# Altium schematic sheet 06_Audio & HSMCI & TWI.SchDoc
size 420 x 297 mm
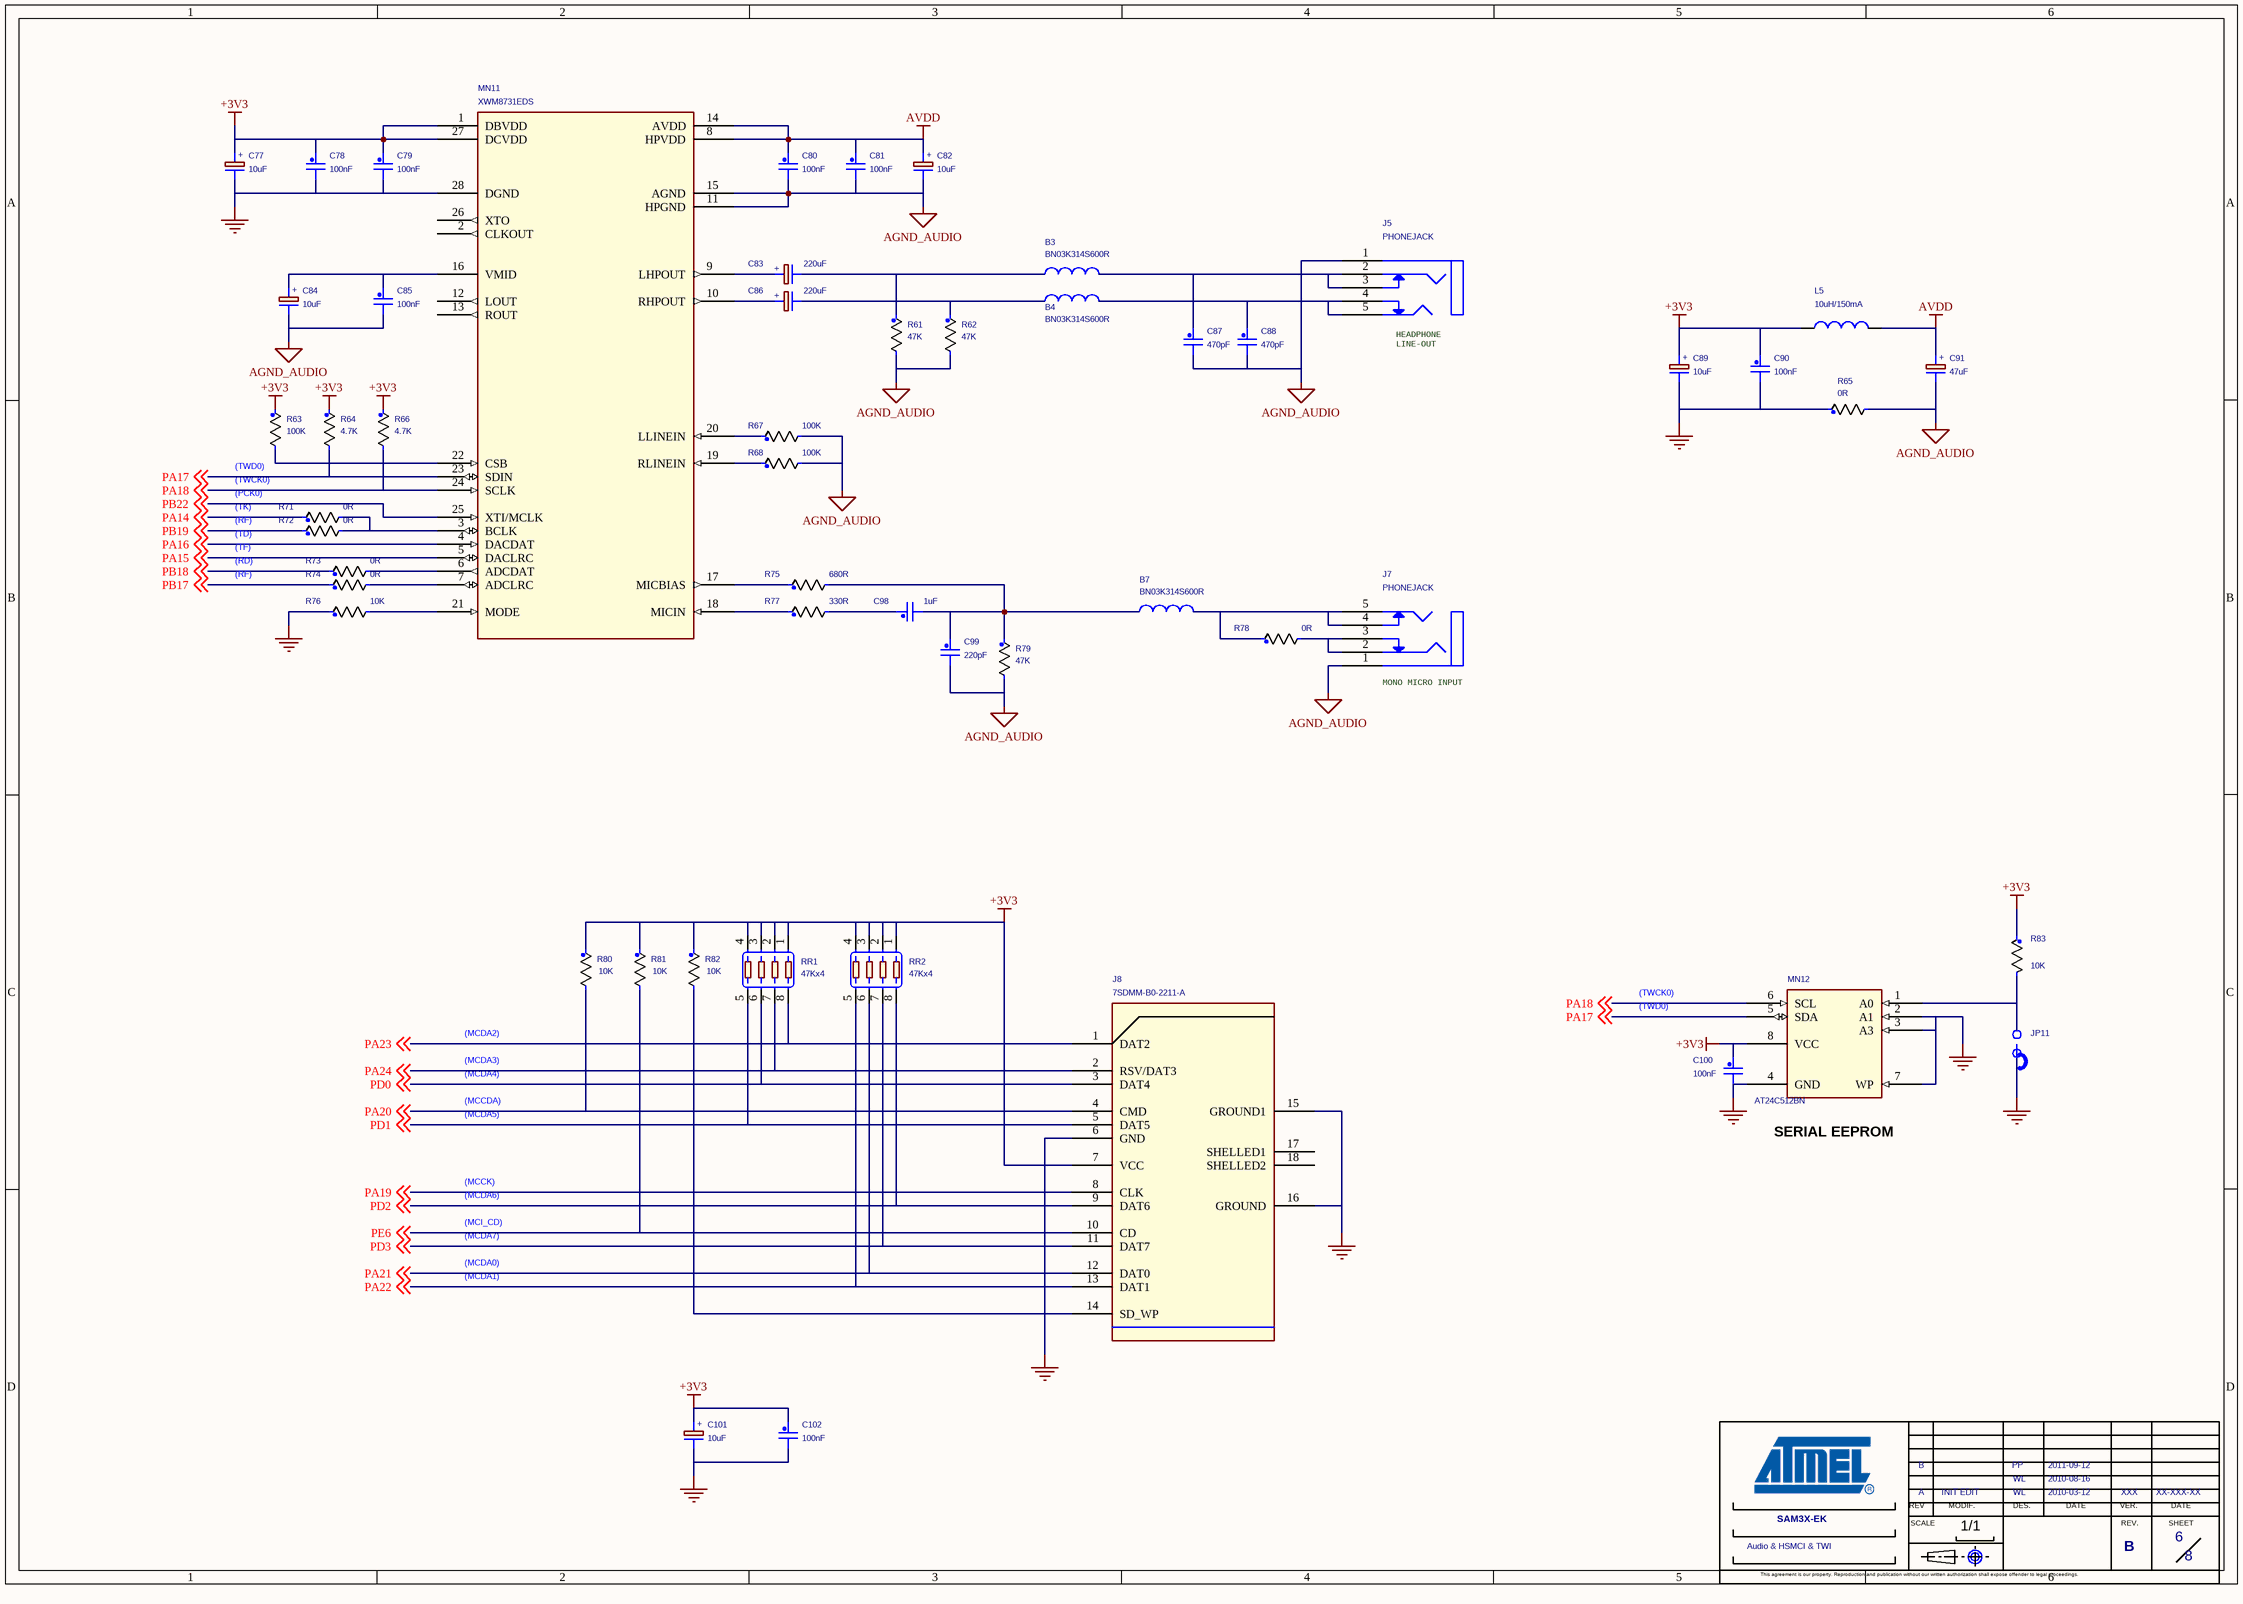
[diagram p0: 06_Audio & HSMCI & TWI.SchDoc]

## Parts
*  SHEET NAME 1: Audio & HSMCI & TWI  REV C: B  VERIF A: XXX  VERIF DATE A: XX-XXX-XX  Page Count: 8  Page Number: 6  DATE A: 2010-03-12  DATE B: 2010-08-16  DATE C: 2011-09-12  DES A: WL  DES C: PP  BOARD NAME: SAM3X-EK  VERSION: A  MODIF. DESCRIBE: INIT EDIT  (hidden comment: ATMEL ARM)  (graphical)
B3  BN03K314S600R  [LC1206]
B4  BN03K314S600R  [LC1206]
B7  BN03K314S600R  [LC1206]
C77  10uF  [C3216-18]
C78  100nF  [CAP0805]
C79  100nF  [CAP0805]
C80  100nF  [CAP0805]
C81  100nF  [CAP0805]
C82  10uF  [C3216-18]
C83  220uF  [T6032]
C84  10uF  [C3216-18]
C85  100nF  [CAP0805]
C86  220uF  [T6032]
C87  470pF  [CAP0805]
C88  470pF  [CAP0805]
C89  10uF  [C3216-18]
C90  100nF  [CAP0805]
C91  47uF  [C3528-21]
C98  1uF  [CAP0805]
C99  220pF  [CAP0805]
C100  100nF  [CAP0805]
C101  10uF  [C3216-18]
C102  100nF  [CAP0805]
J5  PHONEJACK  [audio_jack]
J7  PHONEJACK  [audio_jack]
J8  7SDMM-B0-2211-A  [sd-7sdmm]
JP11  JP  [BAR2PTS02]  (value not drawn)
L5  10uH/150mA  [NLFV25T]
MN11  XWM8731EDS  [TSSOP28]
MN12  AT24C512BN  [so8]
R61  47K  [R0603]
R62  47K  [R0603]
R63  100K  [R0603]
R64  4.7K  [R0603]
R65  0R  [R0603]
R66  4.7K  [R0603]
R67  100K  [R0603]
R68  100K  [R0603]
R71  0R  [R0603]
R72  0R  [R0603]
R73  0R  [R0603]
R74  0R  [R0603]
R75  680R  [R0603]
R76  10K  [R0603]
R77  330R  [R0603]
R78  0R  [R0603]
R79  47K  [R0603]
R80  10K  [R0603]
R81  10K  [R0603]
R82  10K  [R0603]
R83  10K  [R0603]
RR1  47Kx4  [RESP4R]
RR2  47Kx4  [RESP4R]
SH17  Jumper Pitch 2.54  [JUMPER-2.54]  (value not drawn)

## Nets
+3V3: C77.1 C78.1 C79.1 C89.1 C90.1 C100.1 C101.1 C102.1 J8.7(VCC) L5.2 MN11.1(DBVDD) MN11.27(DCVDD) MN12.8(VCC) R63.1 R64.1 R66.1 R80.1 R81.1 R82.1 R83.1 RR1.1 RR1.2 RR1.3 RR1.4 RR2.1 RR2.2 RR2.3 RR2.4
AGND_AUDIO: C80.2 C81.2 C82.2 C84.2 C85.2 C87.2 C88.2 C91.2 C99.2 J5.1(E) J7.1(E) MN11.11(HPGND) MN11.15(AGND) R61.2 R62.2 R65.2 R67.2 R68.2 R79.2
AVDD: C80.1 C81.1 C82.1 C91.1 L5.1 MN11.8(HPVDD) MN11.14(AVDD)
GND_POWER: C77.2 C78.2 C79.2 C89.2 C90.2 C100.2 C101.2 C102.2 J8.6(GND) J8.15(GROUND1) J8.16(GROUND) JP11.1 MN11.28(DGND) MN12.2(A1) MN12.3(A3) MN12.4(GND) MN12.7(WP) R65.1 R76.1
PA14: R71.1 ; off-sheet PA14
PA15: MN11.5(DACLRC) ; off-sheet PA15
PA16: MN11.4(DACDAT) ; off-sheet PA16
PA17: MN11.23(SDIN) MN12.5(SDA) R64.2 ; off-sheet PA17
PA18: MN11.24(SCLK) MN12.6(SCL) R66.2 ; off-sheet PA18
PA19: J8.8(CLK) ; off-sheet PA19
PA20: J8.4(CMD) R80.2 ; off-sheet PA20
PA21: J8.12(DAT0) RR2.6 ; off-sheet PA21
PA22: J8.13(DAT1) RR2.5 ; off-sheet PA22
PA23: J8.1(DAT2) RR1.8 ; off-sheet PA23
PA24: J8.2(RSV/DAT3) RR1.7 ; off-sheet PA24
PB17: R74.1 ; off-sheet PB17
PB18: R73.1 ; off-sheet PB18
PB19: R72.1 ; off-sheet PB19
PB22: MN11.25(XTI/MCLK) ; off-sheet PB22
PD0: J8.3(DAT4) RR1.6 ; off-sheet PD0
PD1: J8.5(DAT5) RR1.5 ; off-sheet PD1
PD2: J8.9(DAT6) RR2.8 ; off-sheet PD2
PD3: J8.11(DAT7) RR2.7 ; off-sheet PD3
PE6: J8.10(CD) R81.2 ; off-sheet PE6
NetB3_1: B3.1 C83.2 R61.1
NetB3_2: B3.2 C87.1 J5.2(D) J5.3(C)
NetB4_1: B4.1 C86.2 R62.1
NetB4_2: B4.2 C88.1 J5.4(B) J5.5(A)
NetB7_1: B7.1 C98.2 C99.1 R75.2 R79.1
NetB7_2: B7.2 J7.4(B) J7.5(A) R78.1
NetC83_1: C83.1 MN11.9(LHPOUT)
NetC84_1: C84.1 C85.1 MN11.16(VMID)
NetC86_1: C86.1 MN11.10(RHPOUT)
NetC98_1: C98.1 R77.2
NetJ7_2: J7.2(D) J7.3(C) R78.2
NetJ8_14: J8.14(SD_WP) R82.2
NetJP11_2: JP11.2 MN12.1(A0) R83.2
NetMN11_3: MN11.3(BCLK) R71.2 R72.2
NetMN11_6: MN11.6(ADCDAT) R73.2
NetMN11_7: MN11.7(ADCLRC) R74.2
NetMN11_17: MN11.17(MICBIAS) R75.1
NetMN11_18: MN11.18(MICIN) R77.1
NetMN11_19: MN11.19(RLINEIN) R68.1
NetMN11_20: MN11.20(LLINEIN) R67.1
NetMN11_21: MN11.21(MODE) R76.2
NetMN11_22: MN11.22(CSB) R63.2

Not connected (* = marked no-connect by the designer): J8 17(SHELLED1) 18(SHELLED2); MN11 2(CLKOUT) 12(LOUT) 13(ROUT) 26(XTO)

## Notes on the sheet
- (near J5) HEADPHONE
  LINE-OUT
- (near R63) (TWD0)
- (near R63) (TWCK0)
- (PCK0)
- (TK)
- (RF)
- (TD)
- (TF)
- (RD)
- (near J7) MONO MICRO INPUT
- (TWCK0)
- (MCDA2)
- (MCDA3)
- (TWD0)
- (MCCDA)
- (MCDA4)
- (MCDA5)
- SERIAL EEPROM
- (MCCK)
- (MCDA6)
- (MCDA7)
- (MCDA0)
- (MCI_CD)
- (MCDA1)
- (in symbol ATMEL ARM) REV; MODIF.; DES.; DATE; VER.; SCALE; REV.; SHEET; 1/1; This agreement is our property. Reproduction and publication without our written authorization shall expose offender to legal proceedings.
- (in symbol CAP_PN) +

## Library data of the parts
* = ATMEL ARM: REV D: D; REV F: F; REV E: E; REV B: B; VERIF F: XXX; VERIF E: XXX; VERIF D: XXX; VERIF C: XXX; VERIF B: XXX; VERIF DATE F: XX-XXX-XX; VERIF DATE E: XX-XXX-XX; VERIF DATE D: XX-XXX-XX; VERIF DATE C: XX-XXX-XX; REV: B; VERIF DATE B: XX-XXX-XX; FT: ?; Page Size: A; Page Create Date: june 19, 2004; DATE D: XX-XXX-XX; DATE E: XX-XXX-XX; DATE F: XX-XXX-XX; DES E: XXX; DES F: XXX; DES B: WL; DES D: XXX
B3 B7 = inductor: BOI: 0603; DESIG: SMD EMI Suppression Ferrite Beads; DEV: R0603; FAB: GAUSSTEK GARP; REF: BN03K314S600R; VAL: BN03K314S600R
B4 = inductor: FAB: GAUSSTEK GARP; DEV: R0603; DESIG: SMD EMI Suppression Ferrite Beads; BOI: 0603; VAL: BN03K314S600R; REF: BN03K314S600R
C77 C82 C84 C89 = CAP_PN: SDTSourceLibName: C:\WINDOWS\TEMP\SNDS.LIB; BOI: A; DESIG: LOW ESR TANTALUM CAPACITOR; DEV: 3216; FAB: AVX; REF: TPSA106K010R1800; TEN: 10V; TOL: 10%; Dielectric: X5R; VAL: 10uF
C78-C81 C85 C90 C102 = C_Generic: Toler.: 10%; P/N #1: C0603C104K4RAC; Voltage: 16V; Mfg #1: KEMET; Dielectric: X7R; BOI: 0603; DESIG: Ceramic Capacitor; DEV: C0603; FAB: TDK; REF: C1608X7R1C104KT; VAL: 100nF; TEN: 16V; TOL: 10%
C83 = CAP_PN: SDTSourceLibName: C:\WINDOWS\TEMP\SNDS.LIB; TOL: 10%; TEN: 6.3V; REF: TPSC227K006R0250; FAB: AVX; DEV: 6032; DESIG: LOW ESR TANTALUM CAPACITOR; BOI: C; Dielectric: X5R; VAL: 220uF
C86 = CAP_PN: SDTSourceLibName: C:\WINDOWS\TEMP\SNDS.LIB; BOI: C; DESIG: LOW ESR TANTALUM CAPACITOR; DEV: 6032; FAB: AVX; REF: TPSC227K006R0250; TEN: 6.3V; TOL: 10%; Dielectric: X5R; VAL: 220uF
C87 = C_Generic: Toler.: 10%; P/N #1: C0603C104K4RAC; Voltage: 50V; Mfg #1: KEMET; Dielectric: X7R; BOI: 0603; DESIG: Ceramic Capacitor; DEV: C0603; FAB: TDK; REF: C1608X7R1H471KT; TEN: 16V; VAL: 470pF; TOL: 10%
C88 = C_Generic: Toler.: 10%; P/N #1: C0603C104K4RAC; Voltage: 50V; Mfg #1: KEMET; Dielectric: X7R; TEN: 16V; REF: C1608X7R1H471KT; FAB: TDK; DEV: C0603; DESIG: Ceramic Capacitor; BOI: 0603; TOL: 10%; VAL: 470pF
C91 = CAP_PN: SDTSourceLibName: C:\WINDOWS\TEMP\SNDS.LIB; TOL: 10%; TEN: 6.3V; REF: TPSB476K010R0500; FAB: AVX; DEV: 3528O; DESIG: LOW ESR TANTALUM CAPACITOR; BOI: B; Dielectric: X5R; VAL: 47uF
C98 = C_Generic: Toler.: 10%; P/N #1: C0603C104K4RAC; Voltage: 16V; Mfg #1: KEMET; Dielectric: X5R; BOI: 0603; DESIG: X5R CERAMIC CAPACITOR; DEV: C0603; FAB: TDK; REF: C1608X5R1H105KT; TEN: 50V; VAL: 1uF; TOL: 10%
C99 = C_Generic: Toler.: 10%; P/N #1: C0603C104K4RAC; Voltage: 50V; Mfg #1: KEMET; Dielectric: X7R; TEN: 16V; REF: C1608X7R1H221KT; FAB: TDK; DEV: C0603; DESIG: Ceramic Capacitor; BOI: 0603; TOL: 10%; VAL: 220pF
C100 = C_Generic: Toler.: 10%; P/N #1: C0603C104K4RAC; Voltage: 16V; Mfg #1: KEMET; Dielectric: X7R; REF: C1608X7R1C104KT; FAB: TDK; DEV: C0603; DESIG: Ceramic Capacitor; BOI: 0603; TOL: 10%; TEN: 16V; VAL: 100nF
C101 = CAP_PN: SDTSourceLibName: C:\WINDOWS\TEMP\SNDS.LIB; Dielectric: X5R; TOL: 10%; TEN: 10V; REF: TPSA106K010R1800; FAB: AVX; DEV: 3216; DESIG: LOW ESR TANTALUM CAPACITOR; BOI: A; VAL: 10uF
J5 = PHONEJACK: FAB: SHENZHEN YUBO; REF: LF-307; VAL: 3.5 PHONEJACK STEREO
J7 = PHONEJACK: VAL: 3.5 PHONEJACK STEREO; REF: LF-307; FAB: SHENZHEN YUBO
J8 = 7SDMM-B0B2211: FAB: KINGCONN; DESIG: SD/MMC CARD CONNECTOR; REF: 7SDMM-B0-2211-A; VAL: 7SDMM-B0-2211-A
JP11 = JUMP_0: DESIG: 2.54mm Pin Header,Single Row,Straight/Right Angle(2pin); FAB: SHENZHEN SITUO; REF: 045; VAL: 045
L5 = L_0: DESIG: Inductor; FAB: TDK; REF: NLFV25T-100K; VAL: 10uH/150mA
MN11 = XWM8731EDS: FAB: WOLFSON; DEV: SSOP-28; DESIG: Audio CODEC with Headphine Driver; VAL: XWM8731EDS; REF: XWM8731EDS; BOI: SSOP-28
MN12 = AT24_IICflash: IC,Flash,512Kb,IIC, 2.5V~5.5V,SOIC08; Manufacturer: ATMEL; Part Number: 131-00006-1; REF: AT24C512BN-SH25-B; Manufacturer Part Number: AT24C512BN-SH25-B; Part Type: Flash; FAB: ATMEL
R61 R79 = R_Generic: P/N #1: CR10-1001F-T; BOI: 0603; DESIG: RC21 5%; FAB: YAGEO; REF: RC0603JR-0747KL; TOL: 5%; DEV: R0603; VAL: 47K
R62 = R_Generic: P/N #1: CR10-1001F-T; TOL: 5%; REF: RC0603JR-0747KL; FAB: YAGEO; DESIG: RC21 5%; BOI: 0603; VAL: 47K; DEV: R0603
R63 R67 R68 = R_Generic: P/N #1: CR10-1001F-T; TOL: 5%; REF: RC0603JR-07100KL; FAB: YAGEO; DESIG: RC21 5%; BOI: 0603; VAL: 100K; DEV: R0603
R64 = R_Generic: P/N #1: CR10-1001F-T; BOI: 0603; DESIG: RC21 5%; FAB: YAGEO; REF: RC0603JR-074K7L; TOL: 5%; DEV: R0603; VAL: 4.7K
R65 R72 R73 R78 = R_Generic: P/N #1: CR10-1001F-T; TOL: 5%; REF: RC0603JR-070RL; FAB: YAGEO; DESIG: RC21 5%; BOI: 0603; VAL: 0R; DEV: R0603
R66 = R_Generic: P/N #1: CR10-1001F-T; TOL: 5%; REF: RC0603JR-074K7L; FAB: YAGEO; DESIG: RC21 5%; BOI: 0603; VAL: 4.7K; DEV: R0603
R71 R74 = R_Generic: P/N #1: CR10-1001F-T; BOI: 0603; DESIG: RC21 5%; FAB: YAGEO; REF: RC0603JR-070RL; TOL: 5%; DEV: R0603; VAL: 0R
R75 = R_Generic: P/N #1: CR10-1001F-T; BOI: 0603; DESIG: RC21 5%; FAB: YAGEO; REF: RC0603JR-07680RL; TOL: 5%; DEV: R0603; VAL: 680R
R76 R80 R82 R83 = R_Generic: P/N #1: CR10-1001F-T; TOL: 5%; REF: RC0603JR-0710KL; FAB: YAGEO; DESIG: RC21 5%; BOI: 0603; VAL: 10K; DEV: R0603
R77 = R_Generic: P/N #1: CR10-1001F-T; TOL: 5%; REF: RC0603JR-07330RL; FAB: YAGEO; DESIG: RC21 5%; BOI: 0603; VAL: 330R; DEV: R0603
R81 = R_Generic: P/N #1: CR10-1001F-T; BOI: 0603; DESIG: RC21 5%; FAB: YAGEO; REF: RC0603JR-0710KL; TOL: 5%; DEV: R0603; VAL: 10K
RR1 RR2 = RES_ARRAY: TOL: 5%; REF: YC124JR-0747K; FAB: YAGEO; DESIG: Chip Resistor Arrays; BOI: YC124; VAL: 47Kx4
SH17 = JUMPER-2.54: Jumper,2 Points Jumper Pitch 2.54; Part Number: 440-00002-1; Manufacturer: WIESON; Manufacturer Part Number: G4160-1A60BF1U; FAB: NA; REF: JUMPER 2.54; DESIG: 2 POINTS JUMPER PITCH 2.54; VAL: JUMPER 2.54; BOI: NA; Part Type: Jumper